# EAGLE design SENTINEL (EAGLE 9.5.0)
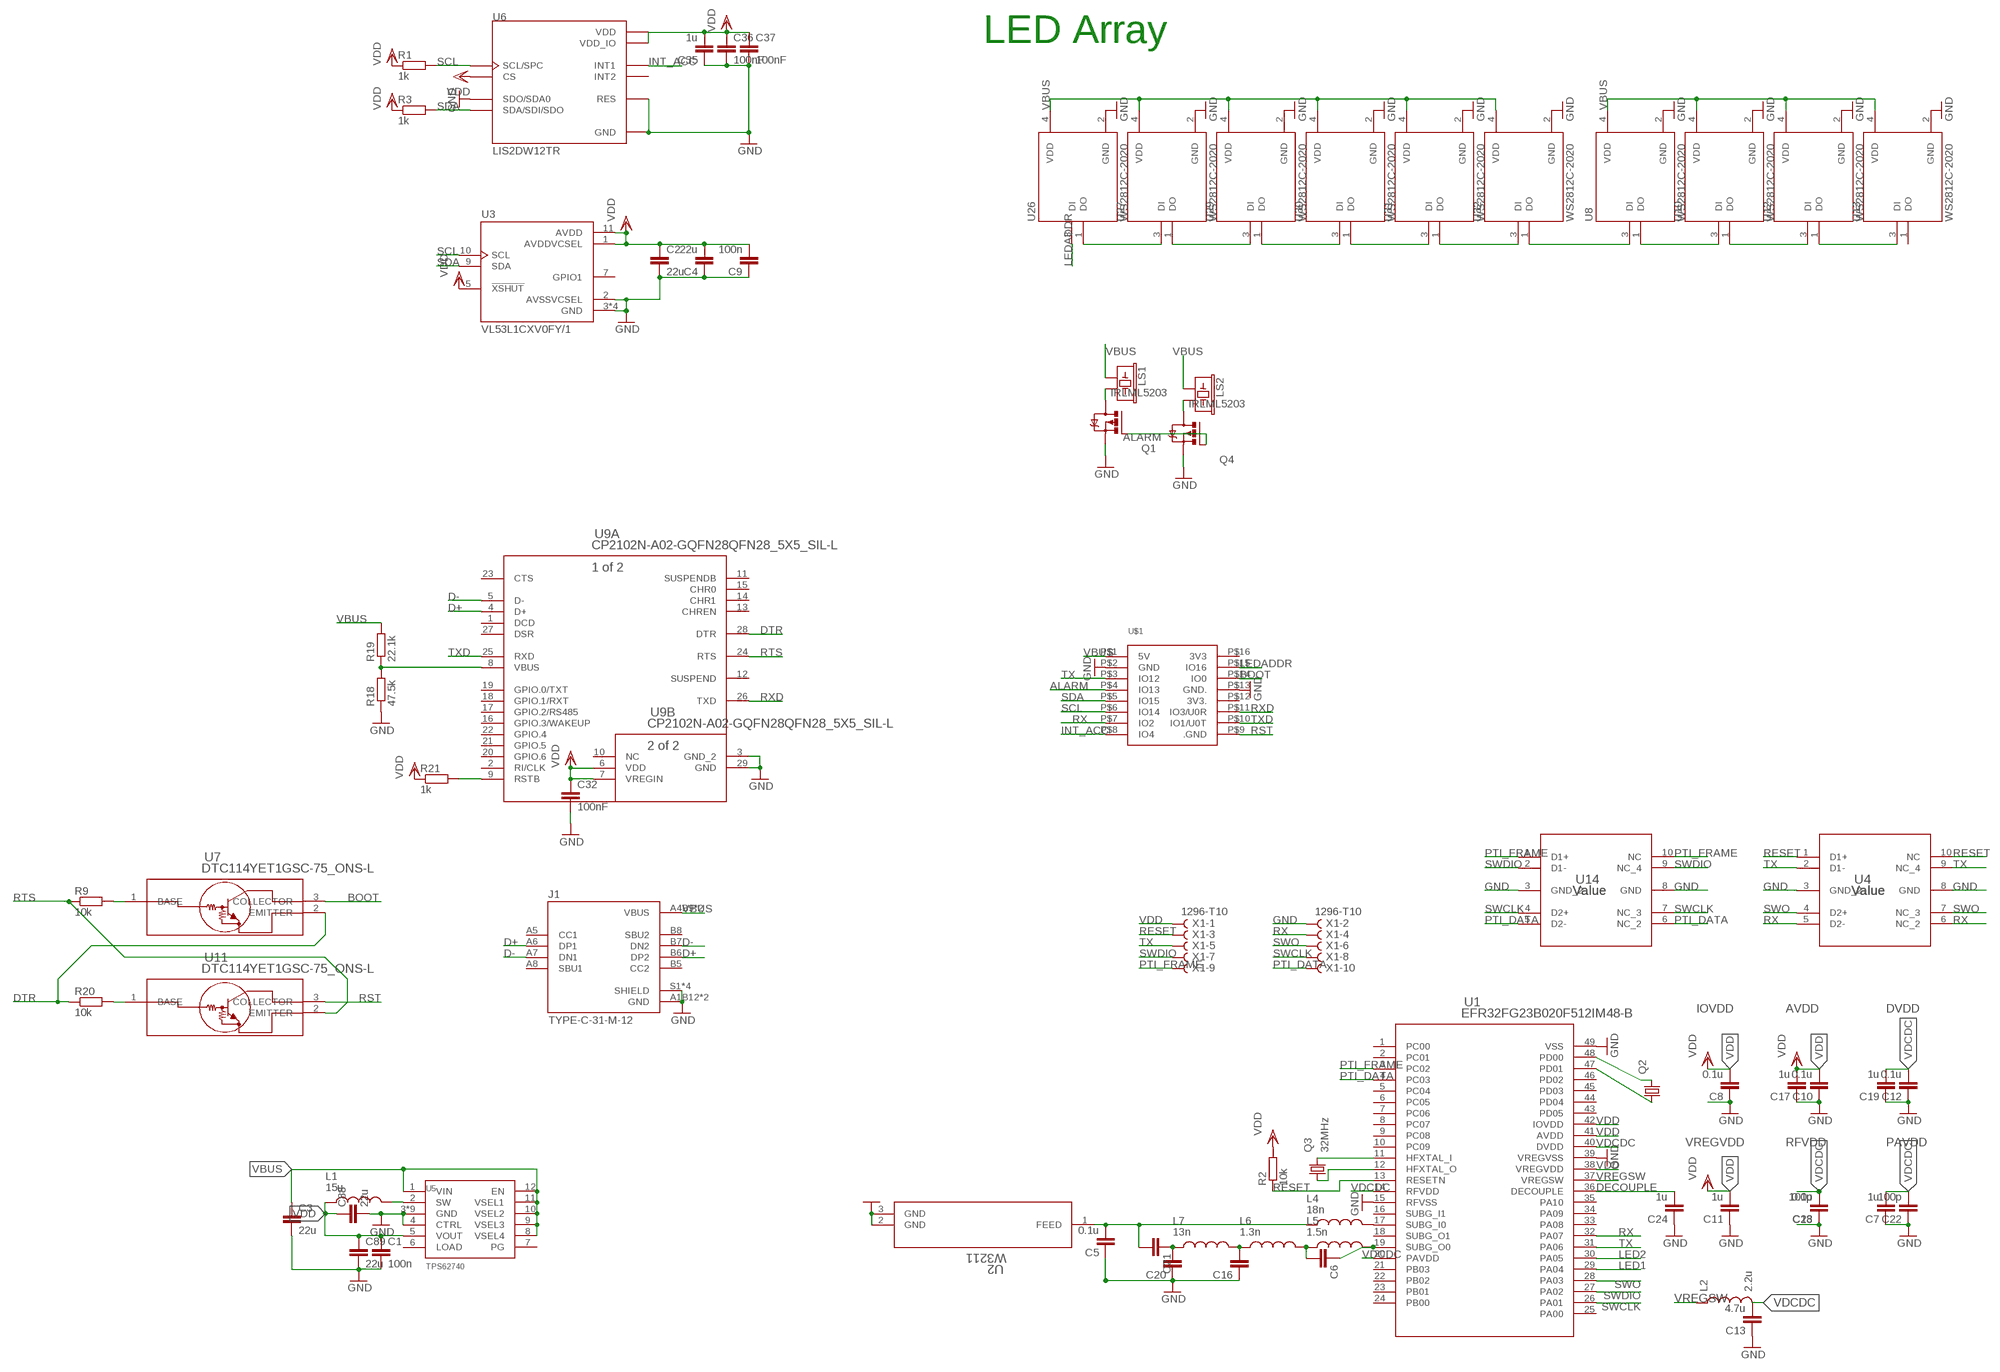
[diagram p0: schematic, sheet 1]

## Parts
C1  100n  CC0402  [C0402]
C2  22u  CC0603R  [C0603R]
C3  22u  CC0603R  [C0603R]
C4  22u  CC0603R  [C0603R]
C5  0.1u  CC0402  [C0402]
C6  1.9p  CC0402  [C0402]
C7  1u  CC0402  [C0402]
C8  0.1u  CC0402  [C0402]
C9  100n  CC0402  [C0402]
C10  0.1u  CC0402  [C0402]
C11  1u  CC0402  [C0402]
C12  0.1u  CC0402  [C0402]
C13  4.7u  CC0603R  [C0603R]
C16  7.2p  CC0402  [C0402]
C17  1u  CC0402  [C0402]
C18  0.1u  CC0402  [C0402]
C19  1u  CC0402  [C0402]
C20  1.3p  CC0402  [C0402]
C21  220p  CC0402  [C0402]
C22  100p  CC0402  [C0402]
C23  100p  CC0402  [C0402]
C24  1u  CC0402  [C0402]
C32  100nF  CC0402  [C0402]
C35  1u  CC0603R  [C0603R]
C36  100nF  CC0402  [C0402]
C37  100nF  CC0402  [C0402]
C88  22u  CC0603R  [C0603R]
C89  22u  CC0603R  [C0603R]
J1  TYPE-C-31-M-12  [HRO_TYPE-C-31-M-12]
L1  15u  1277AS-H-1R5M=P2  [INDC3225X120N]
L2  2.2u  INDUCTOR  [L0603]
L4  18n  MHQ0402P7N5JT000  [INDC0402X26N]
L5  1.5n  MHQ0402P7N5JT000  [INDC0402X26N]
L6  1.3n  MHQ0402P7N5JT000  [INDC0402X26N]
L7  13n  MHQ0402P7N5JT000  [INDC0402X26N]
LS1  BUZZER-PTH_KIT  [BUZZER-12MM-KIT]
LS2  BUZZER-PTH_KIT  [BUZZER-12MM-KIT]
Q1  IRLML5203  [MICRO3]
Q2  KX-327-RT  [2.0X1.2]
Q3  32MHz  KX-5  [2.0X1.6_KX-5]
Q4  IRLML5203  [MICRO3]
R1  1k  RR0402  [R0402]
R2  10k  RR0402  [R0402]
R3  1k  RR0402  [R0402]
R9  10k  RR0402  [R0402]
R18  47.5k  RR0402  [R0402]
R19  22.1k  RR0402  [R0402]
R20  10k  RR0402  [R0402]
R21  1k  RR0402  [R0402]
U1  EFR32FG23B020F512IM48-B  [QFN_48_SIL]
U2  W3211  [CHIP_3211_PUL]
U3  VL53L1CXV0FY/1  [SENSOR_VL53L1CXV0FY/1]
U4  Value  ESD204DQAR  [DQA0010A]
U5  TPS62740  [DSS]
U6  LIS2DW12TR  [LGA12R50P4X4_200X200X70]
U7  DTC114YET1GSC-75_ONS-L  [SC-75_ONS-L]
U8  WS2812C-2020  [LED_WS2812C-2020]
U9  CP2102N-A02-GQFN28QFN28_5X5_SIL-L  [QFN28_5X5_SIL-L]
U10  WS2812C-2020  [LED_WS2812C-2020]
U11  DTC114YET1GSC-75_ONS-L  [SC-75_ONS-L]
U12  WS2812C-2020  [LED_WS2812C-2020]
U13  WS2812C-2020  [LED_WS2812C-2020]
U14  Value  ESD204DQAR  [DQA0010A]
U26  WS2812C-2020  [LED_WS2812C-2020]
U27  WS2812C-2020  [LED_WS2812C-2020]
U29  WS2812C-2020  [LED_WS2812C-2020]
U30  WS2812C-2020  [LED_WS2812C-2020]
U31  WS2812C-2020  [LED_WS2812C-2020]
U32  WS2812C-2020  [LED_WS2812C-2020]
U$1  ESP32-CAM  [ESP32-CAM]
X1  1296-T10  [1296-10]

## Nets
ALARM: Q1.1(G) Q4.1(G) U$1.P$4(IO13)
BOOT: U7.3(COLLECTOR) U$1.P$14(IO0)
D+: J1.A6(DP1) J1.B6(DP2) U9.4(A:D+)
D-: J1.A7(DN1) J1.B7(DN2) U9.5(A:D-)
DECOUPLE: C24.2 U1.36(DECOUPLE)
DTR: R20.1 U7.2(EMITTER) U9.28(A:DTR)
GND: C1.2 C2.2 C3.2 C4.1 C5.1 C7.1 C8.1 C9.1 C10.1 C11.1 C12.1 C13.1 C16.1 C17.1 C18.1 C19.1 C20.1 C22.1 C23.1 C24.1 C32.2 C35.1 C36.2 C37.2 C88.2 C89.2 J1.A1B12(GND) J1.B1A12(GND) J1.S1(SHIELD) J1.S2(SHIELD) J1.S3(SHIELD) J1.S4(SHIELD) Q1.2(S) Q4.2(S) R18.1 U1.15(RFVSS) U1.39(VREGVSS) U1.49(VSS) U2.2(GND) U2.3(GND) U3.2(AVSSVCSEL) U3.3(GND) U3.4(GND) U3.6(GND) U3.12(GND) U4.3(GND_2) U4.8(GND) U5.3(GND) U5.4(CTRL) U5.13(GND) U5.14(GND) U5.15(GND) U5.16(GND) U5.18(GND) U5.19(GND) U5.20(GND) U5.P$18(GND) U6.3(SDO/SDA0) U6.6(GND) U6.7(RES) U6.8(GND) U8.2(GND) U9.3(B:GND_2) U9.29(B:GND) U10.2(GND) U12.2(GND) U13.2(GND) U14.3(GND_2) U14.8(GND) U26.2(GND) U27.2(GND) U29.2(GND) U30.2(GND) U31.2(GND) U32.2(GND) U$1.P$2(GND) U$1.P$13(GND.) X1.2
INT_ACC: U6.12(INT1) U$1.P$8(IO4)
LED1: U1.29(PA04)
LED2: U1.30(PA05)
LEDADDR: U26.3(DI) U$1.P$15(IO16)
N$1: LS1.- Q1.3(D)
N$2: LS2.- Q4.3(D)
N$3: U8.1(DO) U10.3(DI)
N$4: U10.1(DO) U12.3(DI)
N$5: C5.2 C21.2 L4.1 U2.1(FEED)
N$6: C6.1 L5.2 U1.19(SUBG_O0)
N$7: U12.1(DO) U13.3(DI)
N$10: U8.3(DI) U32.1(DO)
N$13: L1.2 U5.2(SW)
N$14: R18.2 R19.1 U9.8(A:VBUS)
N$15: R21.2 U9.9(A:RSTB)
N$16: Q3.3 U1.11(HFXTAL_I)
N$17: Q3.1 U1.12(HFXTAL_O)
N$18: Q2.1 U1.47(PD01)
N$19: Q2.2 U1.48(PD00)
N$20: L4.2 U1.17(SUBG_I0)
N$22: C6.2 L5.1 L6.2
N$23: C16.2 L6.1 L7.2
N$24: C20.2 C21.1 L7.1
N$29: R20.2 U11.1(BASE)
N$30: R9.2 U7.1(BASE)
N$100: U26.1(DO) U27.3(DI)
N$101: U27.1(DO) U29.3(DI)
N$102: U29.1(DO) U30.3(DI)
N$103: U30.1(DO) U31.3(DI)
N$104: U31.1(DO) U32.3(DI)
PTI_DATA: U1.4(PC03) U14.5(D2-) U14.6(NC_2) X1.10
PTI_FRAME: U1.3(PC02) U14.1(D1+) U14.10(NC) X1.9
RESET: R2.1 U1.13(RESETN) U4.1(D1+) U4.10(NC) X1.3
RST: U11.3(COLLECTOR) U$1.P$9(.GND)
RTS: R9.1 U9.24(A:RTS) U11.2(EMITTER)
RX: U1.32(PA07) U4.5(D2-) U4.6(NC_2) U$1.P$7(IO2) X1.4
RXD: U9.26(A:TXD) U$1.P$11(IO3/U0R)
SCL: R1.2 U3.10(SCL) U6.1(SCL/SPC) U$1.P$6(IO14)
SDA: R3.2 U3.9(SDA) U6.4(SDA/SDI/SDO) U$1.P$5(IO15)
SWCLK: U1.26(PA01) U14.4(D2+) U14.7(NC_3) X1.8
SWDIO: U1.27(PA02) U14.2(D1-) U14.9(NC_4) X1.7
SWO: U1.28(PA03) U4.4(D2+) U4.7(NC_3) X1.6
TX: U1.31(PA06) U4.2(D1-) U4.9(NC_4) U$1.P$3(IO12) X1.5
TXD: U9.25(A:RXD) U$1.P$10(IO1/U0T)
VBUS: C3.1 J1.A4B9(VBUS) J1.B4A9(VBUS) LS1.+ LS2.+ R19.2 U5.1(VIN) U5.8(VSEL4) U5.9(VSEL3) U5.10(VSEL2) U5.11(VSEL1) U5.12(EN) U8.4(VDD) U10.4(VDD) U12.4(VDD) U13.4(VDD) U26.4(VDD) U27.4(VDD) U29.4(VDD) U30.4(VDD) U31.4(VDD) U32.4(VDD) U$1.P$1(5V)
VDCDC: C7.2 C12.2 C13.2 C18.2 C19.2 C22.2 C23.2 L2.2 U1.14(RFVDD) U1.20(PAVDD) U1.40(DVDD)
VDD: C1.1 C2.1 C4.2 C8.2 C9.2 C10.2 C11.2 C17.2 C32.1 C35.2 C36.1 C37.1 C88.1 C89.1 L1.1 R1.1 R2.2 R3.1 R21.1 U1.38(VREGVDD) U1.41(AVDD) U1.42(IOVDD) U3.1(AVDDVCSEL) U3.5(!XSHUT) U3.11(AVDD) U5.5(VOUT) U6.2(CS) U6.9(VDD) U6.10(VDD_IO) U9.6(B:VDD) U9.7(B:VREGIN) X1.1
VREGSW: L2.1 U1.37(VREGSW)
Unconnected: J1.A5(CC1) J1.A8(SBU1) J1.B5(CC2) J1.B8(SBU2) U1.1(PC00) U1.2(PC01) U1.5(PC04) U1.6(PC05) U1.7(PC06) U1.8(PC07) U1.9(PC08) U1.10(PC09) U1.16(SUBG_I1) U1.18(SUBG_O1) U1.21(PB03) U1.22(PB02) U1.23(PB01) U1.24(PB00) U1.25(PA00) U1.33(PA08) U1.34(PA09) U1.35(PA10) U1.43(PD05) U1.44(PD04) U1.45(PD03) U1.46(PD02) U3.7(GPIO1) U5.6(LOAD) U5.7(PG) U6.11(INT2) U9.1(A:DCD) U9.2(A:RI/CLK) U9.10(B:NC) U9.11(A:SUSPENDB) U9.12(A:SUSPEND) U9.13(A:CHREN) U9.14(A:CHR1) U9.15(A:CHR0) U9.16(A:GPIO.3/WAKEUP) U9.17(A:GPIO.2/RS485) U9.18(A:GPIO.1/RXT) U9.19(A:GPIO.0/TXT) U9.20(A:GPIO.6) U9.21(A:GPIO.5) U9.22(A:GPIO.4) U9.23(A:CTS) U9.27(A:DSR) U13.1(DO) U$1.P$12(3V3.) U$1.P$16(3V3)

## Notes on the sheet
- LED Array
- IOVDD | AVDD | DVDD
- VREGVDD | RFVDD | PAVDD

## Library data of the parts
C1 C5-C12 C16-C24 C32 C36 C37 = eagle-ltspice:C: CAPACITOR, European symbol; SPICEMODEL: NONE; SPICEPREFIX: C
C2-C4 C13 C35 C88 C89 = eagle-ltspice:C: CAPACITOR, European symbol
J1 = TYPE-C-31-M-12:TYPE-C-31-M-12: USB Connectors 24 Receptacle 1 8.94*7.3mm RoHS Check prices <https://pricing.snapeda.com/parts/TYPE-C-31-M-12/HRO%20Electronics%20Co.%2C%20Ltd./view-part?ref=eda>; AVAILABILITY: Not in stock; DESCRIPTION: USB Connectors 24 Receptacle 1 8.94*7.3mm RoHS; MF: HRO Electronics Co., Ltd.; MP: TYPE-C-31-M-12; PACKAGE: Package; PRICE: None
L1 = 1277AS-H-1R5M_P2:1277AS-H-1R5M=P2: Ind Metal Alloy Shielded 1.5uH 20% 1MHz Powdered Iron 2.6A 1210 T/R Check prices <https://pricing.snapeda.com/parts/1277AS-H-1R5M%3DP2/Murata/view-part?ref=eda>; AVAILABILITY: Warning; DESCRIPTION: Inductor with Inductance: 1.5uH Tol. +/-20%, Package: 1210 (3225); MF: Murata; MP: 1277AS-H-1R5M=P2; PACKAGE: 1210 Murata; PRICE: None; PURCHASE-URL: https://pricing.snapeda.com/search/part/1277AS-H-1R5M=P2/?ref=eda
L2 = BeagleBone_Blue_R3:INDUCTOR: Inductors Basic Inductor/Choke - 0603 and 1206. Footprints are not proven and vary greatly between part numbers. SRN6045- 33uH, 20% 1.4A
L4-L7 = MHQ0402P7N5JT000:MHQ0402P7N5JT000: 221 NH 5% GOLD TERMINAL; AVAILABILITY: Unavailable; DESCRIPTION: FIXED IND 7.5NH 200MA 1.2 OHM; MF: TDK; MP: MHQ0402P7N5JT000; PACKAGE: 0402 TDK; PRICE: None
LS1 LS2 = SparkFun-Electromechanical:BUZZER: Buzzer Small round buzzers that operate around the audible 2kHz range. You can use these as speakers to create simple music or user interfaces. Variant Overview: PTH - Mini Speaker - PC Mount 12mm 2.048kHz <https://www.sparkfun.com/products/7950> PTH_KIT - Mini Speaker - PC Mount 12mm 2.048kHz <https://www.sparkfun.com/products/7950> KIT simplifies soldering by adding stop mask to one side of the pads. PTH_NO_SILK - Mini Speaker - PC Mount 12mm 2.048kHz <https://www.sparkfun.com/products/7950> No silkscreen indicator of buzzer outline. PTH_KIT_NO_SILK - Mini Speaker - PC Mount 12mm 2.048kHz <https://www.sparkfun.com/products/7950> KIT package w/o silkscreen SMD - Buzzer Audio Magnetic (CCV-084B16) SMD buzzer used on, e.g. the LilyPad Buzzer <https://www.sparkfun.com/products/8463> and RFID USB Reader <https://www.sparkfun.com/products/9963>. SMD_KIT - Buzzer Audio Magnetic (CCV-084B16) SMD Buzzer with elongated pins to make soldering easier. Used on the SparkFun Simon Says - Surface Mount Soldering Kit <https://www.sparkfun.com/products/10935>.; PROD_ID: COMP-08253; SF_SKU: COM-07950
Q1 Q4 = transistor-power:IRLML5203: HEXFET P-Channel Power MOSFET
Q2 = crystal-geyer_V1_0:KX-327: Tuning Fork Crystals (kHz) SMD: KX327 - Serie Model Size l/w/h [mm] Frequency Range Frequency Stability Temp. Range [°C] Load Capacitance AECQ 200 availabel Datasheet KX-327VT KX-327FT KX-327RT KX-327NHT KX-327NHF KX-327L KX-327S 1.25/1.05/0.5 1.6/1.0/0.5 2.0/1.2/0.6 3.2/1.5/0.8 3.2/1.5/0.8 7.0/1.5/1.4 8.2/3.8/2.5 32,768 kHz 32,768 kHz 32,768 kHz 32,768 kHz 32,768 kHz 32,768 kHz 32,768 kHz ±10 … ±20ppm ±10 … ±20ppm ±10 … ±20ppm ±10 … ±20ppm ±10 … ±20ppm ±10 … ±20ppm ±5 … ±20ppm (*) -40°C …+85°C (*) -40°C …+85°C (*) -40°C …+85°C (*) -40°C …+85°C (*) -40°C …+125°C (*) -40°C …+85°C (*) -40°C …+85°C 7/9/12,5 7/9/12,5 7/9/12,6 7/9/12,5 9/12,5 7/9/12,5 6/12,5 - - - - yes - - KX-327VT.pdf <http://www.geyer-electronic.de/uploads/tx_userartikelfrequenz/GEYER-KX-327VT.pdf> KX-327FT.pdf <http://www.geyer-electronic.de/uploads/tx_userartikelfrequenz/GEYER-KX-327FT.pdf> KX-327RT.pdf <http://www.geyer-electronic.de/uploads/tx_userartikelfrequenz/GEYER-KX-327RT.pdf> KX-327NHT.pdf <http://www.geyer-electronic.de/uploads/tx_userartikelfrequenz/GEYER-KX-327NHT.pdf> KX-327NHF.pdf <http://www.geyer-electronic.de/uploads/tx_userartikelfrequenz/GEYER-KX-327NHF.pdf> KX-327L.pdf <http://www.geyer-electronic.de/uploads/tx_userartikelfrequenz/GEYER-KX-327L.pdf> KX-327S.pdf <http://www.geyer-electronic.de/uploads/tx_userartikelfrequenz/GEYER-KX-327S.pdf> <http://www.geyer-electronic.de/fileadmin/template/img/logo-geyer-electronic.png> Details see: http://www.geyer-electronic.de/Frequenz-Produkte.9.0.html Created 2016-06-07, Hans Locher 2016 (C) Geyer Quartz Technology KX327VT,KX327FT,KX327RT,KX327NHT,KX327NHF,KX327S,KX327L;125105;1610;2012;3215;7015;8238;1,25x1,05,1.25x1.05;1,6x1,0,1.6x1.0;2,0x1,2,2.0x1.2;3,2x1,5,3.2x1.5;8,2x3,8,8.2x3.8,7.0x1.5,7,0x1,532.768kHz
Q3 = crystal-geyer_V1_0:KX: Quartz Crystals (MHz) SMD: KX - Serie Model Size l/w/h [mm] Frequency Range Frequency Stability Temp. Range [°C] Load Capacitance AECQ 200 availabel Datasheet KX-4 KX-5 KX-6 KX-7 KX-9A KX-9B KX-12A KX-12B KX-13 KX-20 KX-K KX-KS 1.6/1.2/0.3 2.0/1.6/0.45 2.5/2.0/0.55 3.2/2.5/0.8 5.0/3.2/1.0 5.0/3.2/1.1 6.0/3.5/1.1 6.0/3.5/1.0 7.0/5.0 /1.3 11.6/5.5/1.6 12.3/4.5/4.2 12.3/4.5/3.2 24.0 ~ 80.0 MHz 16.0 ~ 80.0 MHz 12.0 ~ 80.0 MHz 8.0 ~ 60.0 MHz 7,68 ~ 300,0 MHz 8,0 ~ 50,0 MHz 8,0 ~ 150,0 MHz 8,0 ~ 50,0 MHz 6,0 ~ 160,0 MHz 3,579 ~ 25,0 MHz 3,579 ~ 70,0 MHz 3,579 ~ 70,0 MHz ±10 … ±50ppm ±10 … ±50ppm ±10 … ±50ppm ±10 … ±50ppm ±10 … ±50ppm ±10 … ±50ppm ±10 … ±50ppm ±10 … ±50ppm ±10 … ±50ppm ±50ppm ±10 … ±50ppm ±10 … ±50ppm (*) -40°C …+85°C (*) -40°C …+125°C (*) -40°C …+125°C (*) -40°C …+125°C (*) -40°C …+105°C (*) -40°C …+105°C (*) -40°C …+125°C (*) -40°C …+105°C (*) -40°C …+105°C (*) -40°C …+105°C (*) -40°C …+85°C (*) -40°C …+85°C 8, 8…16 8, 8…16 10, 8…16 12, 7…20 16, 10…20 16, 10…20 16, 10…20 16, 12…20 16, 12…20 16, 12…20 16, 12…30 16, 12…30 - yes yes yes - - - - - - - - KX-4.pdf <http://www.geyer-electronic.de/uploads/tx_userartikelfrequenz/GEYER-KX-4.pdf> KX-5.pdf <http://www.geyer-electronic.de/uploads/tx_userartikelfrequenz/GEYER-KX-5.pdf> KX-6.pdf <http://www.geyer-electronic.de/uploads/tx_userartikelfrequenz/GEYER-KX-6.pdf> KX-7.pdf <http://www.geyer-electronic.de/uploads/tx_userartikelfrequenz/GEYER-KX-7.pdf> KX-9A.pdf <http://www.geyer-electronic.de/uploads/tx_userartikelfrequenz/GEYER-KX-9A.pdf> KX-9B.pdf <http://www.geyer-electronic.de/uploads/tx_userartikelfrequenz/GEYER-KX-9B.pdf> KX-12A.pdf <http://www.geyer-electronic.de/uploads/tx_userartikelfrequenz/GEYER-KX-12A.pdf> KX-12B.pdf <http://www.geyer-electronic.de/uploads/tx_userartikelfrequenz/GEYER-KX-12B.pdf> KX-13.pdf <http://www.geyer-electronic.de/uploads/tx_userartikelfrequenz/GEYER-KX-13.pdf> KX-20.pdf <http://www.geyer-electronic.de/uploads/tx_userartikelfrequenz/GEYER-KX-20.pdf> KX-K.pdf <http://www.geyer-electronic.de/uploads/tx_userartikelfrequenz/GEYER-KX-K.pdf> KX-KS.pdf <http://www.geyer-electronic.de/uploads/tx_userartikelfrequenz/GEYER-KX-KS.pdf> <http://www.geyer-electronic.de/fileadmin/template/img/logo-geyer-electronic.png> Details see: http://www.geyer-electronic.de/Frequenz-Produkte.9.0.html Created 2016-06-07, Hans Locher 2016 (C) Geyer Quartz Technology KX4,KX5,KX6,KX7,KX9A,KX9B,KX12A,KX12B,KX13,KX20,KXK,KXKS;1612;2016;2520;3225;5032;6035;7050;11655;12345;1,6x1,2;2,0x1,6;2,5x2,0;3,2x2,5;5,0x3,2;6,0x3,5;7,0x5,0;11,6x5,5;12,3x4,5;12,3x4,5;1.6x1.2;2.0x1.6;2.5x2.0;3.2x2.5;5.0x3.2;6.0x3.5;7.0x5.0;11.6x5.5;12.3x4.5;12.3x4.5;
R1-R3 R9 R18-R21 = eagle-ltspice:R: RESISTOR, European symbol; SPICEMODEL: NONE; SPICEPREFIX: R
U1 = EFR32FG23B020F512IM48:EFR32FG23B020F512IM48-B; COPYRIGHT: Copyright (C) 2022 Ultra Librarian. All rights reserved.; MANUFACTURER_PART_NUMBER: EFR32FG23B020F512IM48-B; MFR_NAME: Silicon Labs
U2 = W3211:W3211; COPYRIGHT: Copyright (C) 2022 Ultra Librarian. All rights reserved.; MANUFACTURER_PART_NUMBER: W3211; MFR_NAME: Pulse Electronics Corporation
U3 = VL53L1:VL53L1CXV0FY/1: ToF Proximity 4m Distance Check prices <https://pricing.snapeda.com/search/part/VL53L1CXV0FY/1/?ref=eda>; AVAILABILITY: Good; DESCRIPTION: Optical Sensor 157.480 (4m) I²C Output; MF: STMicroelectronics; MP: VL53L1CXV0FY/1; PACKAGE: LGA-12 STMicroelectronics; PRICE: None; PURCHASE-URL: https://pricing.snapeda.com/search/part/VL53L1CXV0FY/1/?ref=eda
U4 U14 = ESD204DQAR:ESD204DQAR; MANUFACTURER: Texas Instruments; PARTNUMBER: ESD204DQAR; REFDES: RefDes; TYPE: TYPE
U5 = TPS62740:TPS62740: TPS62740- BUCK Converter
U6 = LIS2DW12TR:LIS2DW12TR: Mems Digital Output Motion Sensor Check prices <https://pricing.snapeda.com/parts/LIS2DW12TR/STMicroelectronics/view-part?ref=eda>; AVAILABILITY: Good; DESCRIPTION: Accelerometer X, Y, Z Axis ±2g, 4g, 8g, 16g 400Hz 12-LGA (2x2); MF: STMicroelectronics; MP: LIS2DW12TR; PACKAGE: LGA-12 STMicroelectronics; PRICE: None; PURCHASE-URL: https://pricing.snapeda.com/search/part/LIS2DW12TR/?ref=eda
U7 U11 = DTC114YET1G:DTC114YET1G; BUILT_BY: EMA_Justin; COPYRIGHT: Copyright (C) 2018 Accelerated Designs. All rights reserved; DATASHEET: https://www.onsemi.com/pub/Collateral/DTC114Y-D.PDF; MANUFACTURER_PART_NUMBER: DTC114YET1G; SOURCELIBRARY: ON_Semiconductor_2020-01-13; VENDOR: ON Semiconductor
U8 U10 U12 U13 U26 U27 U29-U32 = WS2812C-2020:WS2812C-2020: Intelligent control LED integrated light source Check prices <https://pricing.snapeda.com/parts/WS2812C-2020/Worldsemi/view-part?ref=eda>; AVAILABILITY: Not in stock; DESCRIPTION: Intelligent control LED integrated light source; MF: Worldsemi; MP: WS2812C-2020; PACKAGE: Package; PRICE: None
U9 = CP2102N:CP2102N-A02-GQFN28; BUILT_BY: EMA_Cory; COPYRIGHT: Copyright (C) 2018 Accelerated Designs. All rights reserved; DATASHEET: https://www.silabs.com/documents/public/data-sheets/cp2102n-datasheet.pdf; MANUFACTURER_PART_NUMBER: CP2102N-A02-GQFN28; SOURCELIBRARY: Silicon_Labs_2020-02-14; VENDOR: Silicon Labs
U$1 = ESP32-CAM:ESP32-CAM: Check availability <https://pricing.snapeda.com/parts/ESP32-CAM/AI-Thinker/view-part?ref=eda>; AVAILABILITY: Not in stock; DESCRIPTION: ESP32 ESP32 Transceiver; 802.11 a/b/g/n (Wi-Fi, WiFi, WLAN), Bluetooth® Smart 4.x Low Energy (BLE) Evaluation Board; MF: AI-Thinker; MP: ESP32-CAM; PACKAGE: None; PRICE: None
X1 = con-leotronics:1296-T10: 1.27mm SINGLE ROW FEMALE SOCKET Source: http://www.leotronics.co.uk/Conexcon/Data%20Sheets/sec.%20A/1296ing.pdf; OC_FARNELL: unknown; OC_NEWARK: unknown

## Net classes
2 NCLS3V7: width 0.178 mm, drill 0.178 mm, clearance 0.178 mm

## Board
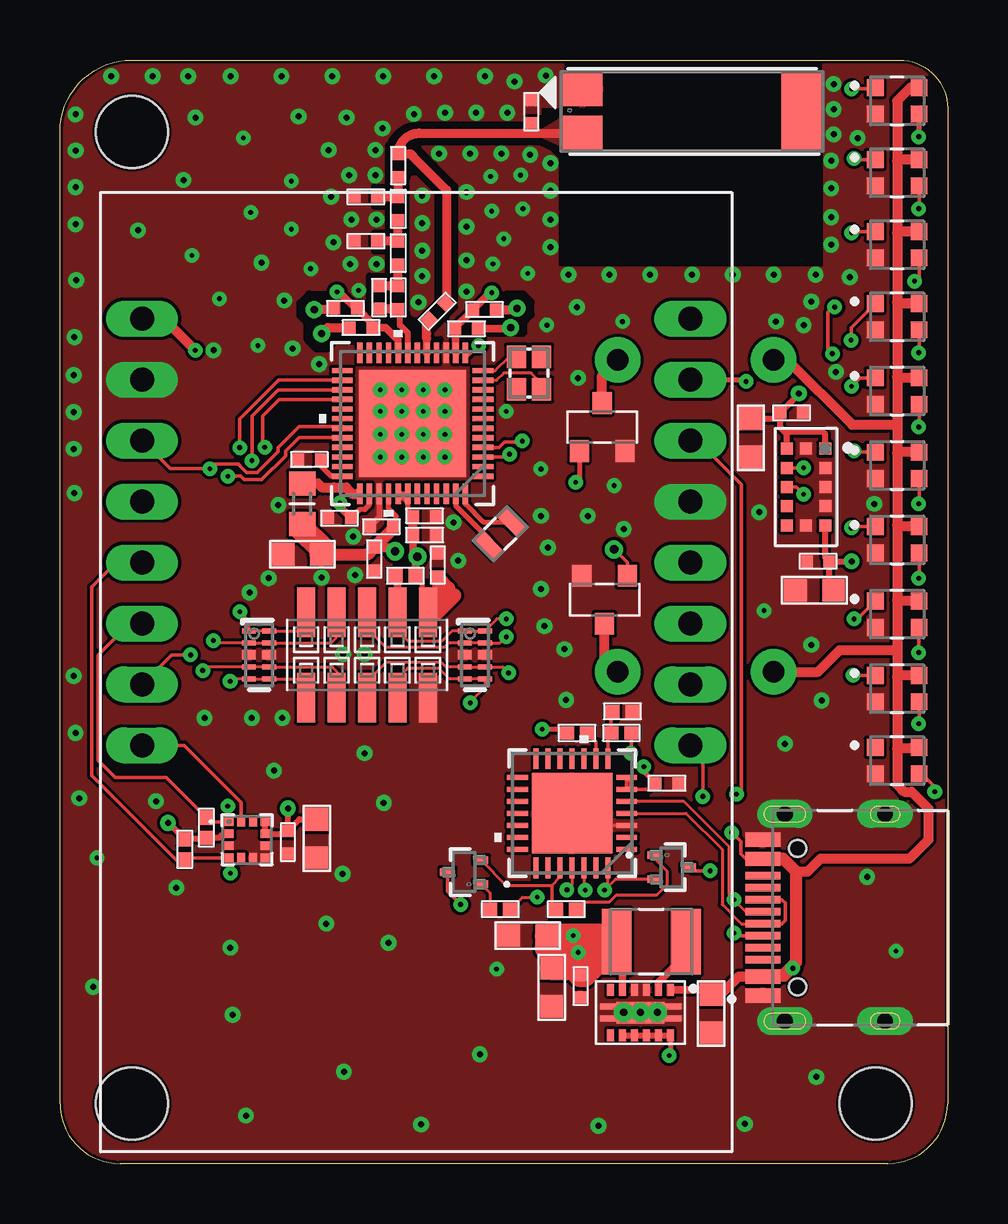
[diagram p1: board, top side]
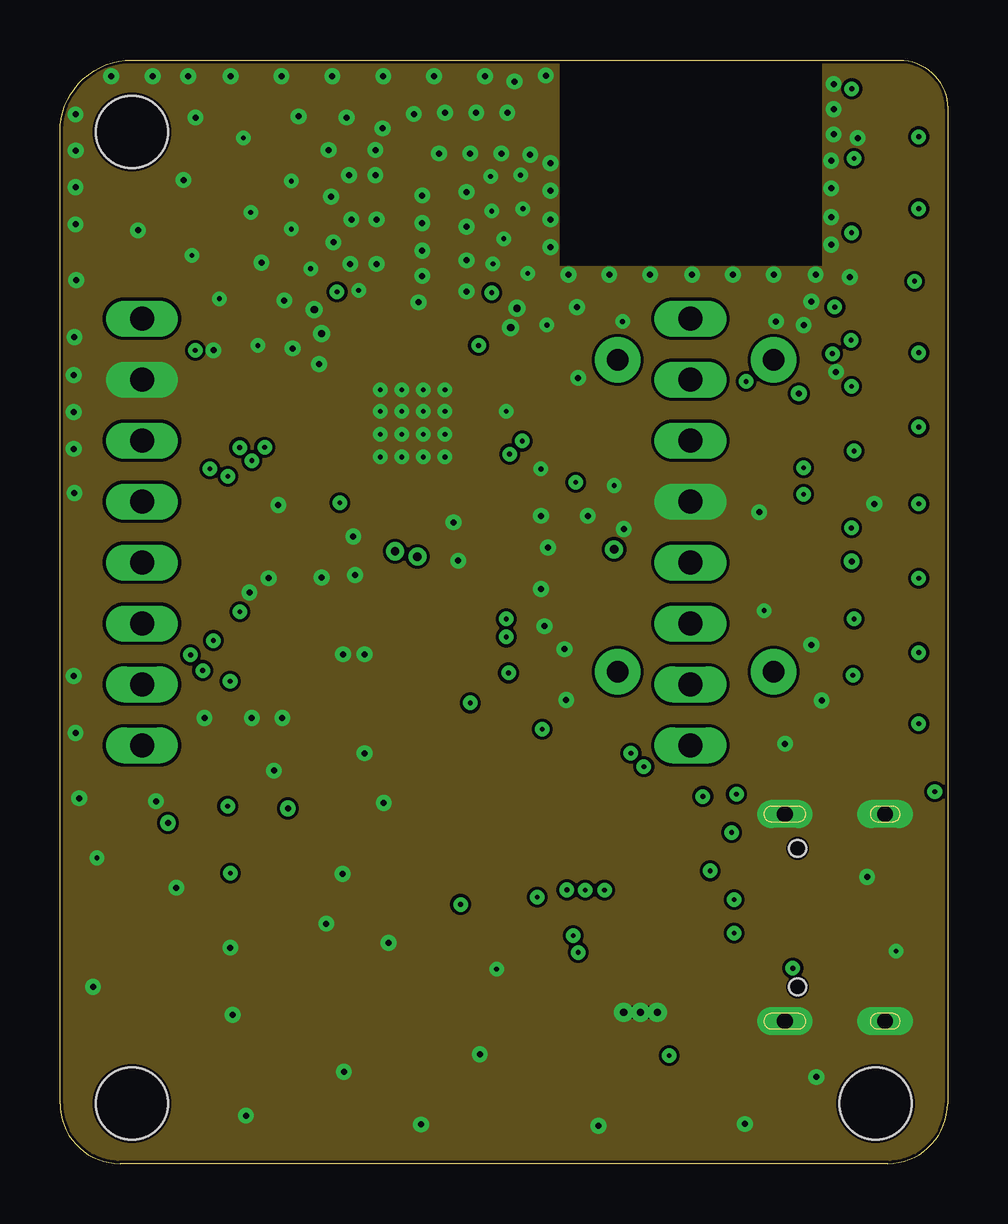
[diagram p2: board, inner layer Route2]
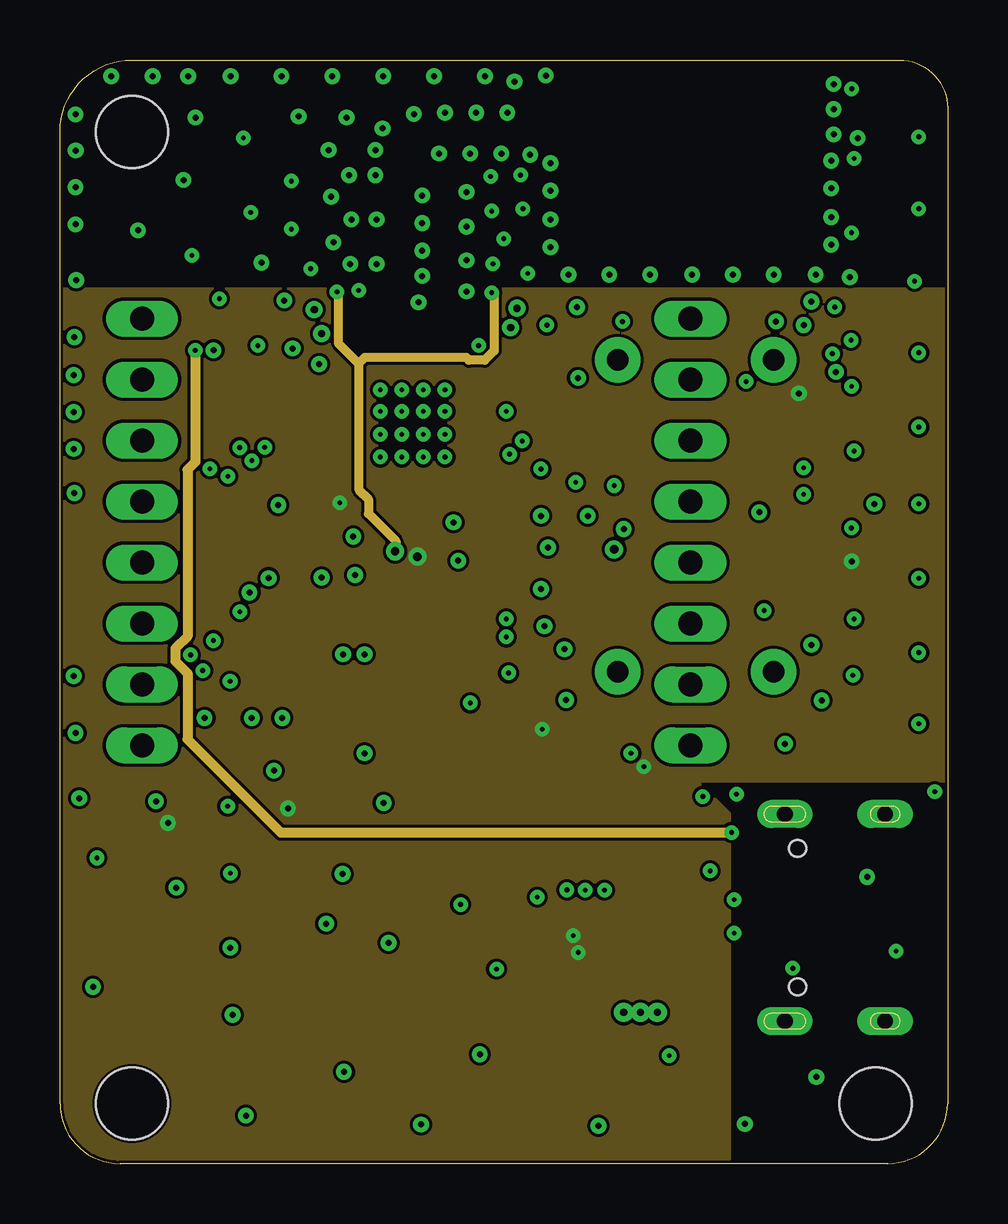
[diagram p3: board, inner layer Route15]
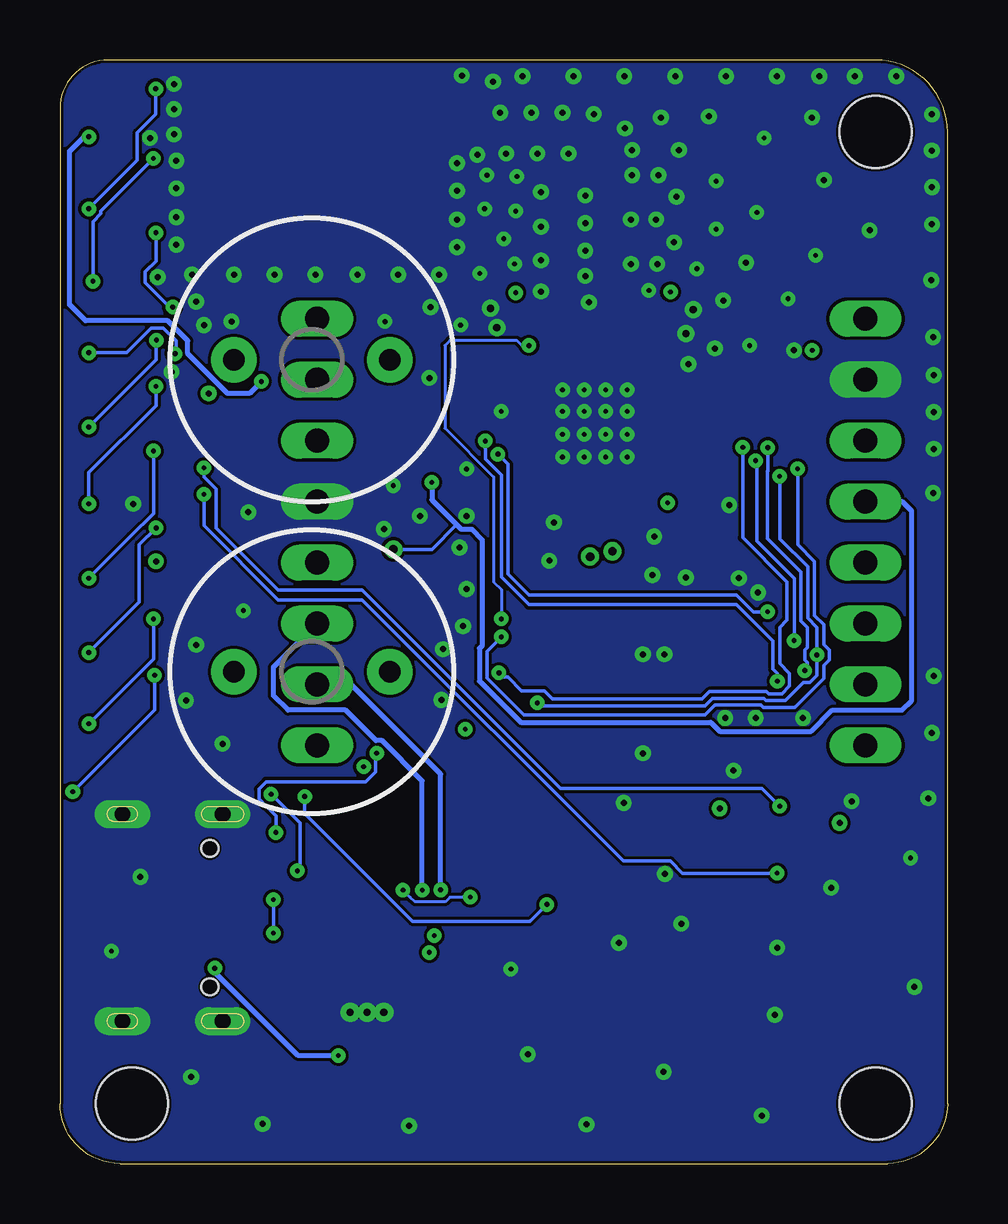
[diagram p4: board, bottom side, seen from below]

Size 37 x 46 mm. Coordinates in mm from the lower left corner, seen from the top.
Outline: 3,46 35,46 arc-90 37,44 37,2.5 arc-90 34.5,0 2.5,0 arc-90 0,2.5 0,43 arc-90 3,46
Copper layers (1+2*15+16): Top 0.035mm / dielectric 0.51mm / Route2 0.035mm / dielectric 0.15mm / Route15 0.035mm / dielectric 0.2mm / Bottom 0.035mm
Design rules "default *": minimum track width 5mil, minimum drill 0.2mm, track to track 5mil, track to pad 5mil, pad to pad 5mil, via to via 5mil, smd to smd 5mil, copper to edge 5mil, drill to drill 6mil, minimum pad ring 10mil, minimum via ring 8mil, stop-mask expansion 0mil, vias tented up to drill 40mil, thermal gap 0mil
Holes 3 mm at 34,2.5 3,2.5 3,43
tRestrict: area 10.1,34 to 12.5,36.2; area 16.8,34.6 to 19.6,36.2; 40 lines

### Footprints (pad centres in the part's own frame; a part is rotated, then mirrored left to right if it is on the bottom)
C0402 = smd 0.5 x 0.5: 1 -0.475,0; 2 0.475,0
C0603R = smd 0.95 x 0.95: 1 -0.85,0; 2 0.75,0
HRO_TYPE-C-31-M-12 = smd 0.6 x 1.45: A1B12 -3.25,5.095; A4B9 -2.45,5.095; B1A12 3.25,5.095; B4A9 2.45,5.095 | smd 0.3 x 1.45: A5 -1.25,5.095; A6 -0.25,5.095; A7 0.25,5.095; A8 1.25,5.095; B5 1.75,5.095; B6 0.75,5.095; B7 -0.75,5.095; B8 -1.75,5.095 | drill 0.65 pad 1.05 long: S1 -4.32,4.18; S2 4.32,4.18; S3 -4.32,0; S4 4.32,0 | hole 0.7: -2.89,3.65; 2.89,3.65
INDC3225X120N = smd 1.24 x 2.72: 1 -1.44,0; 2 1.44,0
L0603 = smd 1 x 1.1: 1 -0.85,0; 2 0.85,0
INDC0402X26N = smd 0.5 x 0.5: 1 -0.732,0; 2 0.232,0
BUZZER-12MM-KIT = drill 0.9 pad 1.88: + 3.25,0; - -3.25,0
MICRO3 = smd 0.8 x 0.9: 1 -0.95,-1; 2 0.95,-1; 3 0,1
2.0X1.2 = smd 0.6 x 1.1: 1 -0.7,0; 2 0.7,0
2.0X1.6_KX-5 = smd 0.95 x 0.8: 1 -0.675,-0.525; 2 0.675,-0.525; 3 0.675,0.525; 4 -0.675,0.525
R0402 = smd 0.6 x 0.55: 1 -0.425,0; 2 0.425,0
QFN_48_SIL = smd 0.86 x 0.22: 1 -2.935,2.2; 2 -2.935,1.8; 3 -2.935,1.4; 4 -2.935,1; 5 -2.935,0.6; 6 -2.935,0.2; 7 -2.935,-0.2; 8 -2.935,-0.6; 9 -2.935,-1; 10 -2.935,-1.4; 11 -2.935,-1.8; 12 -2.935,-2.2; 25 2.935,-2.2; 26 2.935,-1.8; 27 2.935,-1.4; 28 2.935,-1; 29 2.935,-0.6; 30 2.935,-0.2; 31 2.935,0.2; 32 2.935,0.6; 33 2.935,1; 34 2.935,1.4; 35 2.935,1.8; 36 2.935,2.2 | smd 0.22 x 0.86: 13 -2.2,-2.935; 14 -1.8,-2.935; 15 -1.4,-2.935; 16 -1,-2.935; 17 -0.6,-2.935; 18 -0.2,-2.935; 19 0.2,-2.935; 20 0.6,-2.935; 21 1,-2.935; 22 1.4,-2.935; 23 1.8,-2.935; 24 2.2,-2.935; 37 2.2,2.935; 38 1.8,2.935; 39 1.4,2.935; 40 1,2.935; 41 0.6,2.935; 42 0.2,2.935; 43 -0.2,2.935; 44 -0.6,2.935; 45 -1,2.935; 46 -1.4,2.935; 47 -1.8,2.935; 48 -2.2,2.935 | smd 4.45 x 4.45: 49 0,0
CHIP_3211_PUL = smd 1.7 x 1.45: 1 -4.277,-0.9; 3 -4.277,0.95 | smd 1.7 x 3.2: 2 4.877,0
SENSOR_VL53L1CXV0FY/1 = smd 0.5 x 0.5: 1 0.8,1.6; 2 0.8,0.8; 3 0.8,0; 4 0.8,-0.8; 5 0.8,-1.6; 6 0,-1.6; 7 -0.8,-1.6; 8 -0.8,-0.8; 9 -0.8,0; 10 -0.8,0.8; 11 -0.8,1.6; 12 0,1.6
DQA0010A = smd 0.565 x 0.2: 1 -0.417,1; 2 -0.417,0.5; 4 -0.417,-0.5; 5 -0.417,-1; 6 0.417,-1; 7 0.417,-0.5; 9 0.417,0.5; 10 0.417,1 | smd 0.565 x 0.4: 3 -0.417,0; 8 0.417,0
DSS = smd 0.28 x 0.5: 1 0,0; 2 0.5,0; 3 1,0; 4 1.5,0; 5 2,0; 6 2.5,0; 7 2.5,1.9; 8 2,1.9; 9 1.5,1.9; 10 1,1.9; 11 0.5,1.9; 12 0,1.9 | smd 0.7 x 0.25: 13 2.6,0.7; 14 2.6,1.2; 15 -0.1,0.7; 16 -0.1,1.2 | drill 0.3 pad 0.406: 18 0.55,0.95; 20 1.95,0.95; P$18 1.25,0.95 | smd 2 x 0.9: 19 1.25,0.95
LGA12R50P4X4_200X200X70 = smd 0.4 x 0.35: 1 -0.76,0.75; 2 -0.76,0.25; 3 -0.76,-0.25; 4 -0.76,-0.75; 7 0.76,-0.75; 8 0.76,-0.25; 9 0.76,0.25; 10 0.76,0.75 | smd 0.35 x 0.4: 5 -0.25,-0.76; 6 0.25,-0.76; 11 0.25,0.76; 12 -0.25,0.76
SC-75_ONS-L = smd 0.305 x 0.61: 1 -0.5,-0.699; 2 0.5,-0.699; 3 0,0.699
LED_WS2812C-2020 = smd 0.7 x 0.7: 1 -0.915,0.55; 2 -0.915,-0.55; 3 0.915,-0.55; 4 0.915,0.55
QFN28_5X5_SIL-L = smd 0.864 x 0.203: 1 -2.273,1.5; 2 -2.273,1; 3 -2.273,0.5; 4 -2.273,0; 5 -2.273,-0.5; 6 -2.273,-1; 7 -2.273,-1.5; 15 2.273,-1.5; 16 2.273,-1; 17 2.273,-0.5; 18 2.273,0; 19 2.273,0.5; 20 2.273,1; 21 2.273,1.5 | smd 0.203 x 0.864: 8 -1.5,-2.273; 9 -1,-2.273; 10 -0.5,-2.273; 11 0,-2.273; 12 0.5,-2.273; 13 1,-2.273; 14 1.5,-2.273; 22 1.5,2.273; 23 1,2.273; 24 0.5,2.273; 25 0,2.273; 26 -0.5,2.273; 27 -1,2.273; 28 -1.5,2.273 | smd 3.353 x 3.353: 29 0,0
ESP32-CAM = drill 1 pad 1.422 long: P$1 -11.43,10.16; P$2 -11.43,7.62; P$3 -11.43,5.08; P$4 -11.43,2.54; P$5 -11.43,0; P$6 -11.43,-2.54; P$7 -11.43,-5.08; P$8 -11.43,-7.62; P$9 11.43,-7.62; P$10 11.43,-5.08; P$11 11.43,-2.54; P$12 11.43,0; P$13 11.43,2.54; P$14 11.43,5.08; P$15 11.43,7.62; P$16 11.43,10.16
1296-10 = smd 0.76 x 2.05: 1 -2.54,-1.78; 2 -2.54,1.78; 3 -1.27,-1.78; 4 -1.27,1.78; 5 0,-1.78; 6 0,1.78; 7 1.27,-1.78; 8 1.27,1.78; 9 2.54,-1.78; 10 2.54,1.78

### Placement (x,y rotation side)
C1  21.7,7.4 270 top
C2  28.8,30.2 270 top
C3  27.15,6.2 270 top
C4  10.7,13.6 90 top
C5  19.65,43.85 270 top
C6  13.3,36.1 90 top
C7  13.1,25.2 90 top
C8  15.75,24.95 270 top
C9  9.5,13.4 90 top
C10  15.2,26.2 180 top
C11  11.65,26.9 0 top
C12  17.7,35.6 180 top
C13  10.15,25.4 0 top
C16  12.75,38.45 0 top
C17  15.2,27 180 top
C18  11.9,35.65 0 top
C19  13.4,26.55 0 top
C20  12.75,40.3 0 top
C21  14.1,41.6 90 top
C22  12.55,34.85 0 top
C23  16.95,34.8 180 top
C24  10.4,29.35 0 top
C32  25.3,15.85 0 top
C35  31.5,23.9 0 top
C36  30.5,31.3 0 top
C37  31.6,25.1 180 top
C88  19.45,9.5 180 top
C89  20.5,7.3 270 top
J1  34.4,10.25 90 top
L1  24.65,9.25 0 top
L2  10.1,27.5 270 top
L4  15.55,35.35 225 top
L5  14.1,35.85 270 top
L6  14.1,37.7 270 top
L7  14.1,39.55 270 top
LS1  26.5,33.5 180 bottom
LS2  26.5,20.5 180 bottom
Q1  22.6,30.7 0 top
Q2  18.35,26.25 45 top
Q3  19.55,32.95 270 top
Q4  22.7,23.5 180 top
R1  6.1,14 90 top
R2  14.4,24.5 0 top
R3  5.2,13.1 270 top
R9  21.1,10.6 0 top
R18  23.45,18.85 180 top
R19  23.4,17.95 0 top
R20  18.35,10.6 180 top
R21  21.55,17.95 0 top
U1  14.7,30.85 180 top
U2  26.05,43.85 0 top
U3  31.1,28.2 0 top
U4  17.3,21.2 0 top
U5  25.45,7.25 180 top
U6  7.8,13.5 0 top
U7  25.5,12.35 270 top
U8  34.9,26 0 top
U9  21.35,14.6 180 top
U10  34.9,22.9 0 top
U11  16.85,12.15 90 top
U12  34.9,19.8 0 top
U13  34.9,16.8 0 top
U14  8.3,21.2 0 top
U26  34.9,44.3 0 top
U27  34.9,41.3 0 top
U29  34.9,38.3 0 top
U30  34.9,35.3 0 top
U31  34.9,32.2 0 top
U32  34.9,29.1 0 top
U$1  14.85,25.05 0 top
X1  12.8,21.2 180 top

### Tracks (layer width: path | path; a pad name or v marks a point on that pad's centre or on a via)
ALARM  (via drill 0.2, 0.35)
  Top 0.152: Q4.1 23.65,25.05 v23.1,25.6
  Top 0.203: Q1.1 21.65,28.55 v21.5,28.4
  Bottom 0.152: v23.1,25.6 21.5,25.6 20.47,26.63
  Bottom 0.203: v21.5,28.4 21.5,27.66 20.47,26.63 20.28,26.44 19.84,26.44 19.4,26 19.4,21.58 19.51,21.47 19.51,20.11 17.79,18.39 9.87,18.39 9.5,18.02 5.68,18.02 4.8,18.9 1.9,18.9 1.5,19.3 1.5,27.2 1.89,27.59 U$1.P$4
BOOT  (via drill 0.2)
  Top 0.152: U$1.P$14 26.57,30.13 28.4,28.3 28.4,15.6 v28.2,15.4 | v27.1,12.2 26.35,12.2 U7.3
  Bottom 0.152: v28.2,15.4 27,14.2 27,12.3 v27.1,12.2
D+
  Top 0.127: U9.4 26.1,14.6 27.61,13.09 27.61,10.8 28.4,10 J1.A6
  Top 0.152: J1.A6 30.1,10 30.23,10.13 30.23,10.87 30.1,11 J1.B6
D-  (via drill 0.2)
  Top 0.127: J1.A7 28.6,10.5 v28.1,11 27.9,11.2 27.9,13.2 26,15.1 U9.5
  Top 0.152: J1.B7 28.4,9.5 28.3,9.6 v28.1,9.6
  Bottom 0.152: v28.1,9.6 v28.1,11
DECOUPLE
  Top 0.203: 10.88,29.29 C24.2 10.91,29.32 10.91,29.05 11.3,28.65 U1.36
DTR  (via drill 0.2)
  Top 0.127: R20.1 19.27,11.1 v19.9,11.1 | U9.28 22.85,11.55 v22.7,11.4 23.15,11.85 U7.2
  Bottom 0.127: v19.9,11.1 20.74,11.1 20.93,10.91 22.2,10.91 22.4,11.1 v22.7,11.4
GND  (via drill 0.2, 0.25, 0.3)
  Top 0.15: 14.8,30.4 14.7,30.5 14.65,30.35
  Top 0.152: U9.3 21.85,14.1 U9.29
  Top 0.254: U1.39 13.3,26.93 C19.1
  Top 0.305: C23.1 18.74,34.8 v18.79,34.85
  Top 0.368: 11.43,35.5 C18.1 11.38,35.6 v10.6,35.6 | 18.17,35.55 C12.1 19.05,35.6 v19.05,35.65 | 12.01,34.78 C22.1 11.16,34.85 v10.91,34.6
  other vias: 20.45,41.7 15.1,38.05 15.1,37 14.95,35.9 20.25,45.35 16.95,36.35 11.4,38.4 11.3,40.3 15.1,39.2 15.1,40.35 32.15,39.45 32.15,40.65 32.15,41.8 32.15,38.3 31.5,37.05 29.75,37.05 28.05,37.05 26.35,37.05 24.6,37.05 22.9,37.05 21.2,37.05 20.45,38.2 20.45,39.35 20.45,40.55 32.25,42.9 32.25,43.95 32.25,45 18.2,8.1 23.1,28.26 1.54,12.74 20.05,28.95 34.85,8.85 5.5,37.85 18.05,37.5 19.2,41.2 19.3,39.8 17.95,41.15 18,39.7 18.5,38.55 12.45,36.4 20.2,22.4 7.2,6.2 4.85,11.5 4,15.1 7.75,2 28.55,1.65 5.65,43.6 17.5,4.55 20.05,27 3.25,38.9 16.95,40.5 16.95,39.05 16.95,37.65 31,34.95 21.55,35.7 21.6,32.75 33.65,11.95 23.5,26.45 12.15,39.35 13.2,39.35 15.8,42.1 13.15,42.25 12.05,41.2 14.75,43.75 13.45,43.15 13.15,41.2 11.95,43.6 11.2,42.25 9.95,43.65 12.7,17.1 16.05,43.8 12.1,37.5 13.2,37.5 0.65,40.7 0.65,39.15 22,27 0.65,17.95 13.7,9.2 8.7,24.4 6.4,33.9 9.1,27.45 0.6,27.95 0.6,34.45 30.23,17.5 31.33,21.62 21.03,21.44 1.38,7.36 12.23,26.13 31.53,3.61 31.33,35.93 32.93,36.95 0.58,31.32 0.58,29.79 0.68,36.82 0.58,32.86 0.66,42.23 17.72,45.33 15.6,45.33 13.47,45.33 11.35,45.33 9.23,45.33 7.11,45.33 5.34,45.33 8.92,16.38 20.35,25.68 3.86,45.33 2.14,45.33 0.65,43.73 11.84,3.83 21.1,19.33 9.27,18.58 8,18.58 6.02,18.58 15.05,1.63 11.78,12.08 13.5,15.03 0.58,20.33 0.8,15.23 7.9,23.8 22.45,1.58 18.65,43.8 17.35,43.8 18.95,45.1 17.1,42.1 18.4,42.1 19.6,42.05 8.4,37.55 19.5,37.1 6.65,36.05 20.3,34.95 18.6,31.35 9.65,38.95 9.65,40.95 7.95,39.65 7.65,42.75 10.45,37.3 5.15,41 23.45,35.1 29.35,23.05 8.25,34.1 20.05,23.95 16.05,30.4 15.15,30.4 14.25,30.4 13.35,30.4 13.35,31.35 14.25,31.35 15.15,31.35 16.05,31.35 16.05,32.25 15.15,32.25 14.25,32.25 13.35,32.25 14.25,29.45 13.35,29.45 15.15,29.45 16.05,29.45 11.8,21.23 12.7,21.23 12.3,24.53 10.9,24.43 16.6,25.13 16.4,26.73 10.8,33.33 9.7,33.98 9.35,35.98 29.15,27.15 33.25,42.75 29.85,35.1 31.75,19.3 32.35,33 7.1,9 11.1,10 33.95,27.5
  pour Top: -0.5,46.5 20.95,46.5 20.95,45.35 22.6,45.35 22.6,44.05 20,44.05 20,42.6 20.75,41.85 20.75,37.35 31.85,37.35 31.85,42.2 30.15,42.2 30.15,45.3 31.85,45.3 31.85,46.5 37.1,46.5 37.1,0.1 -0.5,0.1
  pour Bottom: -0.5,46.55 36.9,46.55 36.9,0.1 -0.5,0.1
  pour Route2: 0,45.95 20.75,45.95 20.75,37.35 31.85,37.35 31.85,46 37,46 37,0.1 0,0.1
INT_ACC
  Top 0.152: U$1.P$8 5.17,17.43 7.55,15.05 U6.12
LEDADDR  (via drill 0.2)
  Top 0.203: U$1.P$15 28.53,32.67 v28.6,32.6 | U26.3 35.8,43.73 v35.8,42.8
  Bottom 0.2: 36.6,35.8 36.6,42.2
  Bottom 0.203: v28.6,32.6 29.1,32.1 30.01,32.1 31.67,33.76 31.67,34.3 32.5,35.13 35.93,35.13 36.6,35.8 | 36.6,42.2 36,42.8 v35.8,42.8
N$1
  Top 0.406: Q1.3 22.6,32.85 LS1.-
N$2
  Top 0.406: LS2.- 22.7,21.05 Q4.3
N$3  (via drill 0.2)
  Top 0.15: U10.3 35.8,22.34 v35.8,21.3 | U8.1 33.05,26.55 v32.99,26.49
  Bottom 0.15: v32.99,26.49 33.69,25.79 33.69,23.41 v35.8,21.3
N$4  (via drill 0.2)
  Top 0.15: U12.3 35.81,18.34 v35.8,18.33 | U10.1 33.23,22.7 v33.1,22.7
  Bottom 0.15: v33.1,22.7 33.1,21.03 v35.8,18.33
N$5
  Top 0.15: C5.2 19.65,42.95
  Top 0.203: C21.2 arc90 14.12,42.05 14.65,42.05 14.7,42
  Top 0.368: U2.1 19.65,42.95 14.98,42.95 arc90 C21.2 14.62,42.08 14.65,42.05 | L4.1 16.12,35.92 16.12,40.58 14.7,42
  pour Top (rank 2): 20.01,42.82 21.05,42.36 21.05,43.65 20.05,43.06
N$6
  Top 0.254: L5.2 14.17,35.55 14.17,34.95 14.5,34.62 U1.19
  Top 0.368: L5.2 13.31,35.62 C6.1
N$7  (via drill 0.2)
  Top 0.15: U12.1 v33.07,20.35 v33.06,20.36 | v36.47,15.5 36.47,15.7 35.92,16.25 U13.3
  Bottom 0.15: v33.06,20.36 33.06,18.91 v36.47,15.5
N$10  (via drill 0.2)
  Top 0.15: U8.3 35.81,24.41 v35.8,24.4 | U32.1 33.15,29.65 v33.1,29.7
  Bottom 0.15: v33.1,29.7 33.1,27.1 34.05,26.15 v35.8,24.4
N$13
  Top 0.305: U5.2 24.95,7.55 26.09,8.69 L1.2
N$14
  Top 0.152: U9.8 22.85,17.82 R19.1 22.98,18.8 R18.2
N$15
  Top 0.152: U9.9 22.35,17.57 R21.2
N$16
  Top 0.127: Q3.3 20.08,32.52 19.64,32.95 18.5,32.95 18.2,32.65 U1.11
N$17
  Top 0.127: U1.12 18.15,33.05 18.72,33.62 Q3.1
N$18
  Top 0.203: U1.47 16.5,27.42 17.85,26.06 Q2.1
N$19
  Top 0.127: 16.91,27.99 U1.48
  Top 0.203: U1.48 16.9,27.48 17.64,26.75 Q2.2
N$20
  Top 0.305: U1.17 15.29,34.33 15.29,34.6
  Top 0.368: L4.2 15.39,35.09 15.29,34.99 15.29,34.6 15.29,34.39
N$22
  Top 0.2: 14.1,37.4 L6.2
  Top 0.368: 14.1,37.4 L5.1 C6.2
N$23
  Top 0.2: L6.1 14.1,38.45 | 14.1,38.45 L7.2 | 13.8,38.45 14.1,38.45
  Top 0.368: C16.2 13.8,38.45 14.08,38.45 L6.1 L7.2
N$24
  Top 0.368: C21.1 L7.1 13.24,40.28 C20.2
N$29
  Top 0.127: U11.1 17.92,11.27 R20.2
N$30
  Top 0.127: U7.1 24.8,12.7 25.3,12.2 25.3,11.62 24.88,11.2 23.2,11.2 22.9,10.91 21.83,10.91 R9.2
N$100  (via drill 0.2)
  Top 0.15: U27.3 35.81,39.81 v35.8,39.8 | U26.1 33.94,44.8 v33.01,44.8
  Bottom 0.15: v33.01,44.8 33.01,43.74 33.78,42.97 33.78,41.82 33.9,41.7 v35.8,39.8
N$101  (via drill 0.2)
  Top 0.15: U29.3 35.81,36.97 v35.62,36.78 | U27.1 33.15,41.85 v33.1,41.9
  Bottom 0.15: v33.1,41.9 35.3,39.7 35.3,39.59 35.62,39.26 v35.62,36.78
N$102  (via drill 0.2)
  Top 0.15: U29.1 33.05,38.85 v33,38.8 | U30.3 35.81,33.81 v35.8,33.8 | v32.2,33.76 32,33.96 32,35.5 32.2,35.7 v32.3,35.7
  Bottom 0.15: v35.8,33.8 34.21,33.8 33.19,34.82 33.18,34.82 33.17,34.83 32.69,34.83 32.16,34.3 32.16,33.8 v32.2,33.76 | v33,38.8 33,37.62 33.46,37.17 33.46,36.73 32.43,35.7 v32.3,35.7
N$103  (via drill 0.2)
  Top 0.15: U31.3 35.81,30.71 v35.8,30.7 | U30.1 32.98,34.85 v32.98,34.32
  Bottom 0.15: v32.98,34.32 32.98,33.52 v35.8,30.7
N$104  (via drill 0.2)
  Top 0.15: U32.3 35.81,27.52 v35.8,27.5 | U31.1 33.35,32.75 v33,32.4
  Bottom 0.15: v35.8,27.5 35.8,28.8 33,31.6 v33,32.4
PTI_DATA  (via drill 0.2)
  Top 0.127: X1.10 10.35,19.51 10.35,20.05 10.2,20.2 U14.6 U14.5 7.19,20.2 v7.09,20.11
  Top 0.152: U1.4 18.31,29.85 18.53,30.08 19.23,30.08 v19.27,30.12
  Bottom 0.152: v19.27,30.12 19.27,29.37 18.6,28.7 18.6,24.45 17.45,23.3 8.8,23.3 7.28,21.78 7.28,20.61 7.09,20.43 v7.09,20.11
PTI_FRAME  (via drill 0.2)
  Top 0.127: X1.9 10.26,22.26 10.2,22.2 U14.10 U14.1 7.88,22.62 v7.5,23
  Top 0.152: v18.74,29.57 18.62,29.45 U1.3
  Bottom 0.152: v7.5,23 8.1,23 8.8,23.7 17.45,23.7 18.32,24.57 18.32,29.15 v18.74,29.57
RESET  (via drill 0.2)
  Top 0.127: X1.3 14.07,22.23 14.54,21.76 15.91,21.76 16.35,22.2 U4.1 U4.10 18.22,22.7 v18.6,22.7 | U1.13 16.97,33.62 v17.45,34.1
  Top 0.305: X1.3 14.07,24.41 R2.1
  Bottom 0.127: v17.45,34.1 17.75,34.1 17.96,34.31 20.74,34.31 20.95,34.1 20.95,30.65 18.92,28.62 18.92,24.24 18.6,23.92 v18.6,22.7
RST  (via drill 0.2)
  Top 0.15: U11.3 16.15,11.35 v16.7,10.8 | v26.8,15.3 26.8,16.91 U$1.P$9
  Bottom 0.15: v16.7,10.8 17.4,10.1 22.3,10.1 26.8,14.6 v26.8,15.3
RTS
  Top 0.127: U11.2 18.6,11.6 20.5,11.6 20.85,11.95 U9.24
  Top 0.152: R9.1 20.5,10.78 20.5,11.6
RX  (via drill 0.2)
  Top 0.127: X1.4 13.9,19.59 13.9,20.05 14.48,20.64 15.8,20.64 16.23,20.2 U4.5 U4.6 17.72,19.85 17.1,19.23 v17.1,19.2
  Top 0.15: U$1.P$7 4.65,21.2 v5.44,21.2
  Top 0.152: U1.32 11.69,30.26 9.96,30.26 9.4,29.7 9.4,29.5 8.41,28.51 7.67,28.51 7.54,28.65 v7,28.65
  Bottom 0.152: v7,28.65 6.98,28.63 6.98,26.03 5.83,24.88 5.83,22.73 5.44,22.35 v5.44,21.2 5.44,20.34 5.74,20.04 6.01,20.04 6.76,19.3 7.57,19.3 7.66,19.39 9.81,19.39 10.12,19.08 16.98,19.08 v17.1,19.2
RXD  (via drill 0.2)
  Top 0.127: U9.26 21.85,11.45 v21.9,11.4
  Bottom 0.203: v21.9,11.4 21.9,15.95 23.58,17.63 23.83,17.63 25.1,18.9 27.5,18.9 28.1,19.5 28.1,20.69 U$1.P$11
SCL  (via drill 0.2)
  Top 0.15: U$1.P$6 2.91,22.51 1.6,21.2 1.6,16.8 2.3,16.1 4.43,16.1 R1.2 6.27,14.25 U6.1 6.99,14.3 v6.99,14.89 | v31,29 U3.10
  Bottom 0.15: v31,29 31,28.61 30.49,28.11 30.49,26.5 27.9,23.9 24.41,23.9 16.14,15.63 7.73,15.63 v6.99,14.89
SDA  (via drill 0.2)
  Top 0.15: U$1.P$5 2.35,25.05 1.32,24.02 1.32,16.18 4.82,12.68 R3.2 5.27,12.75 U6.4 7.04,12.16 v7.1,12.1 | v31,27.9 30.7,28.2 U3.9
  Bottom 0.15: v7.1,12.1 11.05,12.1 11.56,12.61 13.51,12.61 24.4,23.5 27.9,23.5 31,26.6 v31,27.9
SWCLK  (via drill 0.2)
  Top 0.127: X1.8 11.55,19.44 11.55,20.5 11.35,20.7 U14.7 U14.4 6.1,20.7 v5.95,20.55
  Top 0.152: v7.49,29.84 7.49,31.04 8.53,32.07 8.6,32.15 9.11,32.65 U1.26
  Bottom 0.152: v5.95,20.55 5.84,20.66 5.84,20.88 5.95,20.99 5.95,21.41 5.84,21.52 5.84,22.35 6.11,22.62 6.11,24.66 7.51,26.06 7.51,28.86 7.49,28.87 v7.49,29.84
SWDIO  (via drill 0.2)
  Top 0.127: X1.7 11.53,21.93 11.3,21.7 U14.9 U14.2 6.5,21.7 v6.4,21.8
  Top 0.152: v8,29.3 8,31.15 9.1,32.25 U1.27
  Bottom 0.152: v6.4,21.8 6.39,21.81 6.39,24.39 7.95,25.95 7.95,29.25 v8,29.3
SWO  (via drill 0.2)
  Top 0.127: X1.6 12.8,20.1 13.59,20.89 15.9,20.89 16.09,20.7 U4.4 U4.7 18.45,20.7 v18.7,20.45
  Top 0.152: v8.53,29.85 8.44,29.94 8.44,31.16 9.14,31.85 U1.28
  Bottom 0.152: v8.53,29.85 8.53,26.08 6.7,24.25 6.7,22.65 7,22.35 7,20.85 6.59,20.44 6.59,19.9 6.91,19.57 7.45,19.57 7.54,19.67 9.92,19.67 10.23,19.36 16.46,19.36 16.81,19.71 17.76,19.71 18.33,20.27 18.52,20.27 v18.7,20.45
TX  (via drill 0.2)
  Top 0.127: X1.5 12.8,22.3 13.59,21.51 16.02,21.51 16.21,21.7 U4.2 U4.9 18.35,21.7 v18.6,21.95
  Top 0.15: U$1.P$3 4.59,28.96 v6.25,28.96
  Top 0.152: U1.31 11.81,30.71 9.97,30.71 9.1,29.84 9.1,29.68 8.21,28.79 7.79,28.79 7.49,29.09 7.49,29.11 7.44,29.16 6.45,29.16 v6.25,28.96
  Bottom 0.152: v6.25,28.96 6.25,25.8 5.55,25.1 5.55,22.85 5.16,22.46 5.16,21.64 4.94,21.41 4.94,20.99 5.16,20.76 5.16,20.23 6.37,19.02 7.68,19.02 7.77,19.11 9.69,19.11 10.11,18.69 17.66,18.69 19.21,20.24 19.21,21.34 v18.6,21.95
TXD  (via drill 0.2)
  Top 0.127: U9.25 21.33,12.31 21.33,11.61 v21.13,11.4
  Bottom 0.203: v21.13,11.4 21.13,16.23 24.87,19.97 U$1.P$10
VBUS  (via drill 0.2)
  Top 0.152: R19.2 23.83,17.12 v23.8,17.1 | v28,13.8 28.38,13.42 28.38,12.92 28.59,12.7 29.8,12.7 | U5.9 24.4,5.35 U5.11 U5.12 | U5.10 24.9,5.35
  Top 0.2: U5.12 25.45,4.55 v25.4,4.5 | 30.35,7.95 v30.55,8.14
  Top 0.254: U5.8 24.4,5.35 24.9,5.35 U5.12
  Top 0.305: U5.1 26.95,7.25 C3.1 | 34.9,29.6 34.9,29.2 | 34.9,29.2 34.9,26.6 | 34.9,29.2 34.95,29.25 | 35.77,32.8 U31.4
  Top 0.406: C3.1 27.55,7.05 28.3,7.8 J1.A4B9 | 30.15,7.86 30.08,7.8 J1.A4B9 | J1.A4B9 30.21,7.8 30.35,7.95 | U$1.P$1 4.33,35.21 v5.64,33.9 | 35.87,29.6 U32.4 34.95,29.65 34.9,29.6 | 30.69,12.17 31.17,12.17 31.7,12.7 35.4,12.7 36.2,13.5 36.2,14.8 35.5,15.5 35.2,15.5 34.9,15.8 34.9,17.3 | U26.4 35.45,44.85 34.9,44.3 34.9,41.8 | 34.9,41.8 34.9,38.8 | 34.9,38.8 34.9,35.9 | 34.9,35.9 34.9,32.8 | 34.9,32.8 34.9,30.8 | 34.9,30.8 34.9,29.6 | 34.9,29.6 34.9,26.6 | 34.9,26.6 34.9,23.5 | 34.9,23.5 34.9,21.4 | 34.9,21.4 34.9,20.3 | LS1.+ 30.33,33.5 33.03,30.8 34.9,30.8 | 34.9,20.3 34.9,17.3 | U13.4 35.77,17.3 34.9,17.3 | U12.4 34.95,20.35 34.9,20.3 | U10.4 34.95,23.45 34.9,23.5 | U8.4 34.95,26.55 34.9,26.6 | U31.4 34.95,32.75 34.9,32.8 | U30.4 34.95,35.85 34.9,35.9 | U29.4 34.95,38.85 34.9,38.8 | U27.4 34.95,41.85 34.9,41.8 | LS2.+ 31.6,20.5 32.5,21.4 34.9,21.4
  Top 0.508: J1.B4A9 29.8,12.7 30.16,12.7 30.69,12.17 30.69,8.41 30.15,7.86
  Route15 0.406: v5.64,33.9 5.64,29.25 5.32,28.92 5.32,21.97 4.81,21.46 4.81,20.94 5.32,20.43 5.32,17.68 9.2,13.8 v28,13.8
  Bottom 0.152: v28,13.8 28,14.5 28.39,14.89 28.41,14.89 28.71,15.19 28.71,15.61 28.41,15.91 24.26,15.91 23.83,16.33 23.83,17.07 v23.8,17.1
  Bottom 0.2: v25.4,4.5 27.07,4.5 30.51,7.94 30.54,7.94 30.6,8 30.6,8.09 v30.55,8.14
VDCDC  (via drill 0.2, 0.35)
  Top 0.2: C19.2 14.02,26.7 | 17.19,35.56 C12.2 17.34,35.71
  Top 0.203: C22.2 13.15,34.85 | 14.02,26.7 14.02,26.98 13.7,27.3 U1.40
  Top 0.254: U1.20 14.1,33.88 14.11,33.89 14.09,33.91 | C23.2 16.48,34.76 16.46,34.74
  Top 0.305: v11.55,36.33 11.7,36.18 11.79,36.18 12.32,35.65 C18.2 13.02,35 C22.2 | v18,36.3 17.83,36.13 17.75,36.13 17.34,35.71 | 17.19,35.56 16.48,34.85 C23.2 16.48,34.74 | C13.2 10.9,25.3 | U1.14 16.49,33.8 16.49,34.48 16.46,34.51 16.46,34.74 | 14.09,33.91 14.09,34.33 13.57,34.85 13.15,34.85
  Top 0.368: C7.2 13.71,25.68 13.87,25.52 v13.97,25.52
  Top 0.508: C13.2 10.98,25.32 11.23,25.32 11.18,25.38 | 11.18,25.38 12.8,25.38 C7.2 13.88,26.45 C19.2 | 11.18,25.38 10.1,26.45 L2.2
  Top 1.016: C13.2 10.9,25.65 10.1,26.45
  Route15 0.368: v13.97,25.52 14,25.55 14,25.95 12.86,27.09 12.86,27.69 12.45,28.1 12.45,33.35 | v11.55,36.33 11.6,36.28 11.6,34.2 12.45,33.35 | 12.45,33.35 12.7,33.6 16.93,33.6 17.05,33.49 17.7,33.49 18.1,33.88 18.1,36.2 v18,36.3
VDD  (via drill 0.2, 0.25, 0.35)
  Top 0.152: U9.6 U9.7 23.71,16.01 | C32.1 24.58,15.6 23.8,15.6 | U9.6 23.8,15.6 | 23.71,16.01 23.8,15.92 | 23.8,15.7 23.8,15.6 | U9.6 23.62,15.92 23.71,16.01
  Top 0.2: U1.38 12.9,28.08
  Top 0.203: R2.2 15.1,24.23 15.1,23.22 X1.1 | U1.38 12.89,27.9 12.89,27.44 12.7,27.26 12.48,27.26 C11.2 | C17.2 14.5,27.23 14.5,27.55 | 14.5,27.55 U1.42 U1.41 14.14,27.91 14.5,27.55 | R21.1 20.98,18.1 v20.1,18.1 | U9.7 23.8,15.92 23.8,15.7 | C32.1 24.34,16.33 v24.34,16.54
  Top 0.254: U3.11 30.3,30.4 | C36.1 30.02,30.68 30.3,30.4 | C36.1 30.6,31.88 30.6,31.9 v30.8,32.1 | C2.1 29.77,31.05 C36.1 | U3.1 31.9,30.4 31.8,30.5 30.4,30.5 30.3,30.4 | C37.1 31.9,25.27 U3.5 | C37.1 v33,25.1 | C35.2 32.08,24.07 C37.1 | U6.2 6.97,13.68 6.73,13.68 6.63,13.57 R1.1 6.05,13.53 R3.1 4.52,14.2 v4.5,14.2 | C9.2 9.38,13.75 U6.9 U6.10 | C9.2 9.98,14.35 C4.2 | C9.2 v9.5,14.8
  Top 0.305: C10.2 14.73,25.48 v14.9,25.3 14.82,25.23 R2.2 | v11.67,27.55 11.67,27.36 C11.2 | U5.5 23.45,9.01 L1.1 23.03,9.07 | 22.68,8.72 23.03,9.07 | C1.1 20.77,7.88 C89.1 20.3,8.35 20.3,9 C88.1 | 23.03,9.3 23.03,9.07
  Top 0.368: C10.2 C17.2
  Top 0.508: 15.75,23.85 C8.2 16.23,24 | 15.6,22.98 15.7,23.08 15.7,23.85 15.75,23.85 | 16.42,23.68 16.25,23.85 15.75,23.85
  Top 0.61: 16.42,23.68 15.73,22.98 15.6,22.98 X1.1
  Top 1.016: C88.1 v21.4,9.5 22.83,9.5 23.03,9.3 | L1.1 22.76,8.8 21.9,8.8 | 20.3,9 20.5,8.8 v21.6,8.8 21.9,8.8 | C89.1 21.25,8.15 21.9,8.8 | C1.1 21.84,7.88 22.68,8.72
  pour Route15: 0,15.95 36.95,15.95 36.95,36.45 0,36.45
  pour Route15: 0.1,16.4 26.1,16.4 27.9,14.6 27.9,0.2 27.7,0 1.5,0 -0.1,1.6 -0.1,16.2
VREGSW
  Top 0.254: 12.2,27.91 U1.37
  Top 0.406: L2.1 10.75,28.35 10.92,28.18 11.41,28.18 | 11.41,28.18 11.93,28.18 12.2,27.91 12.41,27.91 | 11.41,28.18

### Text on the board
tStop: SENTINEL | v2.0